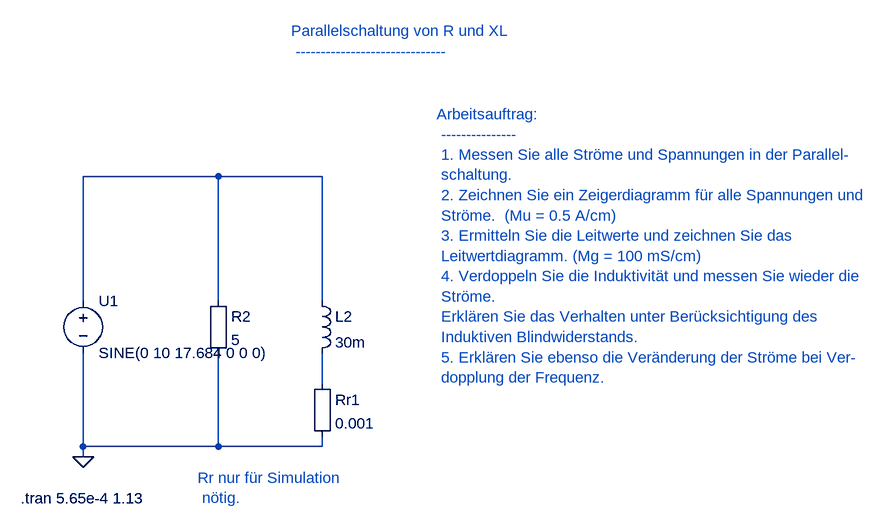
[diagram p0: schematic 14_3_Parallelschaltung_von_R_und_XL.asc]
14_3_Parallelschaltung_von_R_und_XL.asc, the LTspice schematic file:
Version 4
SHEET 1 880 680
WIRE 160 560 160 576
WIRE 160 576 160 704
WIRE 160 704 160 720
WIRE 160 480 160 288
WIRE 160 288 368 288
WIRE 368 560 368 704
WIRE 368 288 368 480
WIRE 528 480 528 288
WIRE 528 288 368 288
WIRE 368 704 160 704
WIRE 528 560 528 608
WIRE 528 688 528 704
WIRE 528 704 368 704
FLAG 160 720 0
SYMBOL voltage 160 464 R0
SYMATTR InstName U1
SYMATTR Value SINE(0 10 17.684 0 0 0)
SYMBOL Misc\EuropeanResistor 352 464 R0
SYMATTR InstName R2
SYMATTR Value 5
SYMBOL ind 512 464 R0
SYMATTR InstName L2
SYMATTR Value 30m
SYMBOL Misc\EuropeanResistor 512 592 R0
SYMATTR InstName Rr1
SYMATTR Value 0.001
TEXT 64 784 Left 2 !.tran 5.65e-4 1.13
TEXT 480 64 Left 2 ;Parallelschaltung von R und XL \n ------------------------------
TEXT 704 192 Left 2 ;Arbeitsauftrag: \n --------------- \n 1. Messen Sie alle Ströme und Spannungen in der Parallel- \n schaltung. \n 2. Zeichnen Sie ein Zeigerdiagramm für alle Spannungen und \n Ströme.  (Mu = 0.5 A/cm) \n 3. Ermitteln Sie die Leitwerte und zeichnen Sie das \n Leitwertdiagramm. (Mg = 100 mS/cm) \n 4. Verdoppeln Sie die Induktivität und messen Sie wieder die \n Ströme. \n Erklären Sie das Verhalten unter Berücksichtigung des \n Induktiven Blindwiderstands. \n 5. Erklären Sie ebenso die Veränderung der Ströme bei Ver- \n dopplung der Frequenz.
TEXT 336 752 Left 2 ;Rr nur für Simulation \n nötig.

The netlist it stands for:
* 14_3_Parallelschaltung_von_R_und_XL.asc
V§U1 N001 0 SINE(0 10 17.684 0 0 0)
R2 N001 0 5
L2 N001 N002 30m
Rr1 N002 0 0.001
.tran 5.65e-4 1.13
* Parallelschaltung von R und XL
*  ------------------------------
* Arbeitsauftrag:
*  ---------------
*  1. Messen Sie alle Ströme und Spannungen in der Parallel-
*  schaltung.
*  2. Zeichnen Sie ein Zeigerdiagramm für alle Spannungen und
*  Ströme.  (Mu = 0.5 A/cm)
*  3. Ermitteln Sie die Leitwerte und zeichnen Sie das
*  Leitwertdiagramm. (Mg = 100 mS/cm)
*  4. Verdoppeln Sie die Induktivität und messen Sie wieder die
*  Ströme.
*  Erklären Sie das Verhalten unter Berücksichtigung des
*  Induktiven Blindwiderstands.
*  5. Erklären Sie ebenso die Veränderung der Ströme bei Ver-
*  dopplung der Frequenz.
* Rr nur für Simulation
*  nötig.
.backanno
.end